# EAGLE design BLE121LR Breakout Board v1.0 (EAGLE 6.4)
BLE112 Breakout Board v2.0 Full breakout board for all BLE112 functions, with optional LEDs, programming header, USB access, etc.
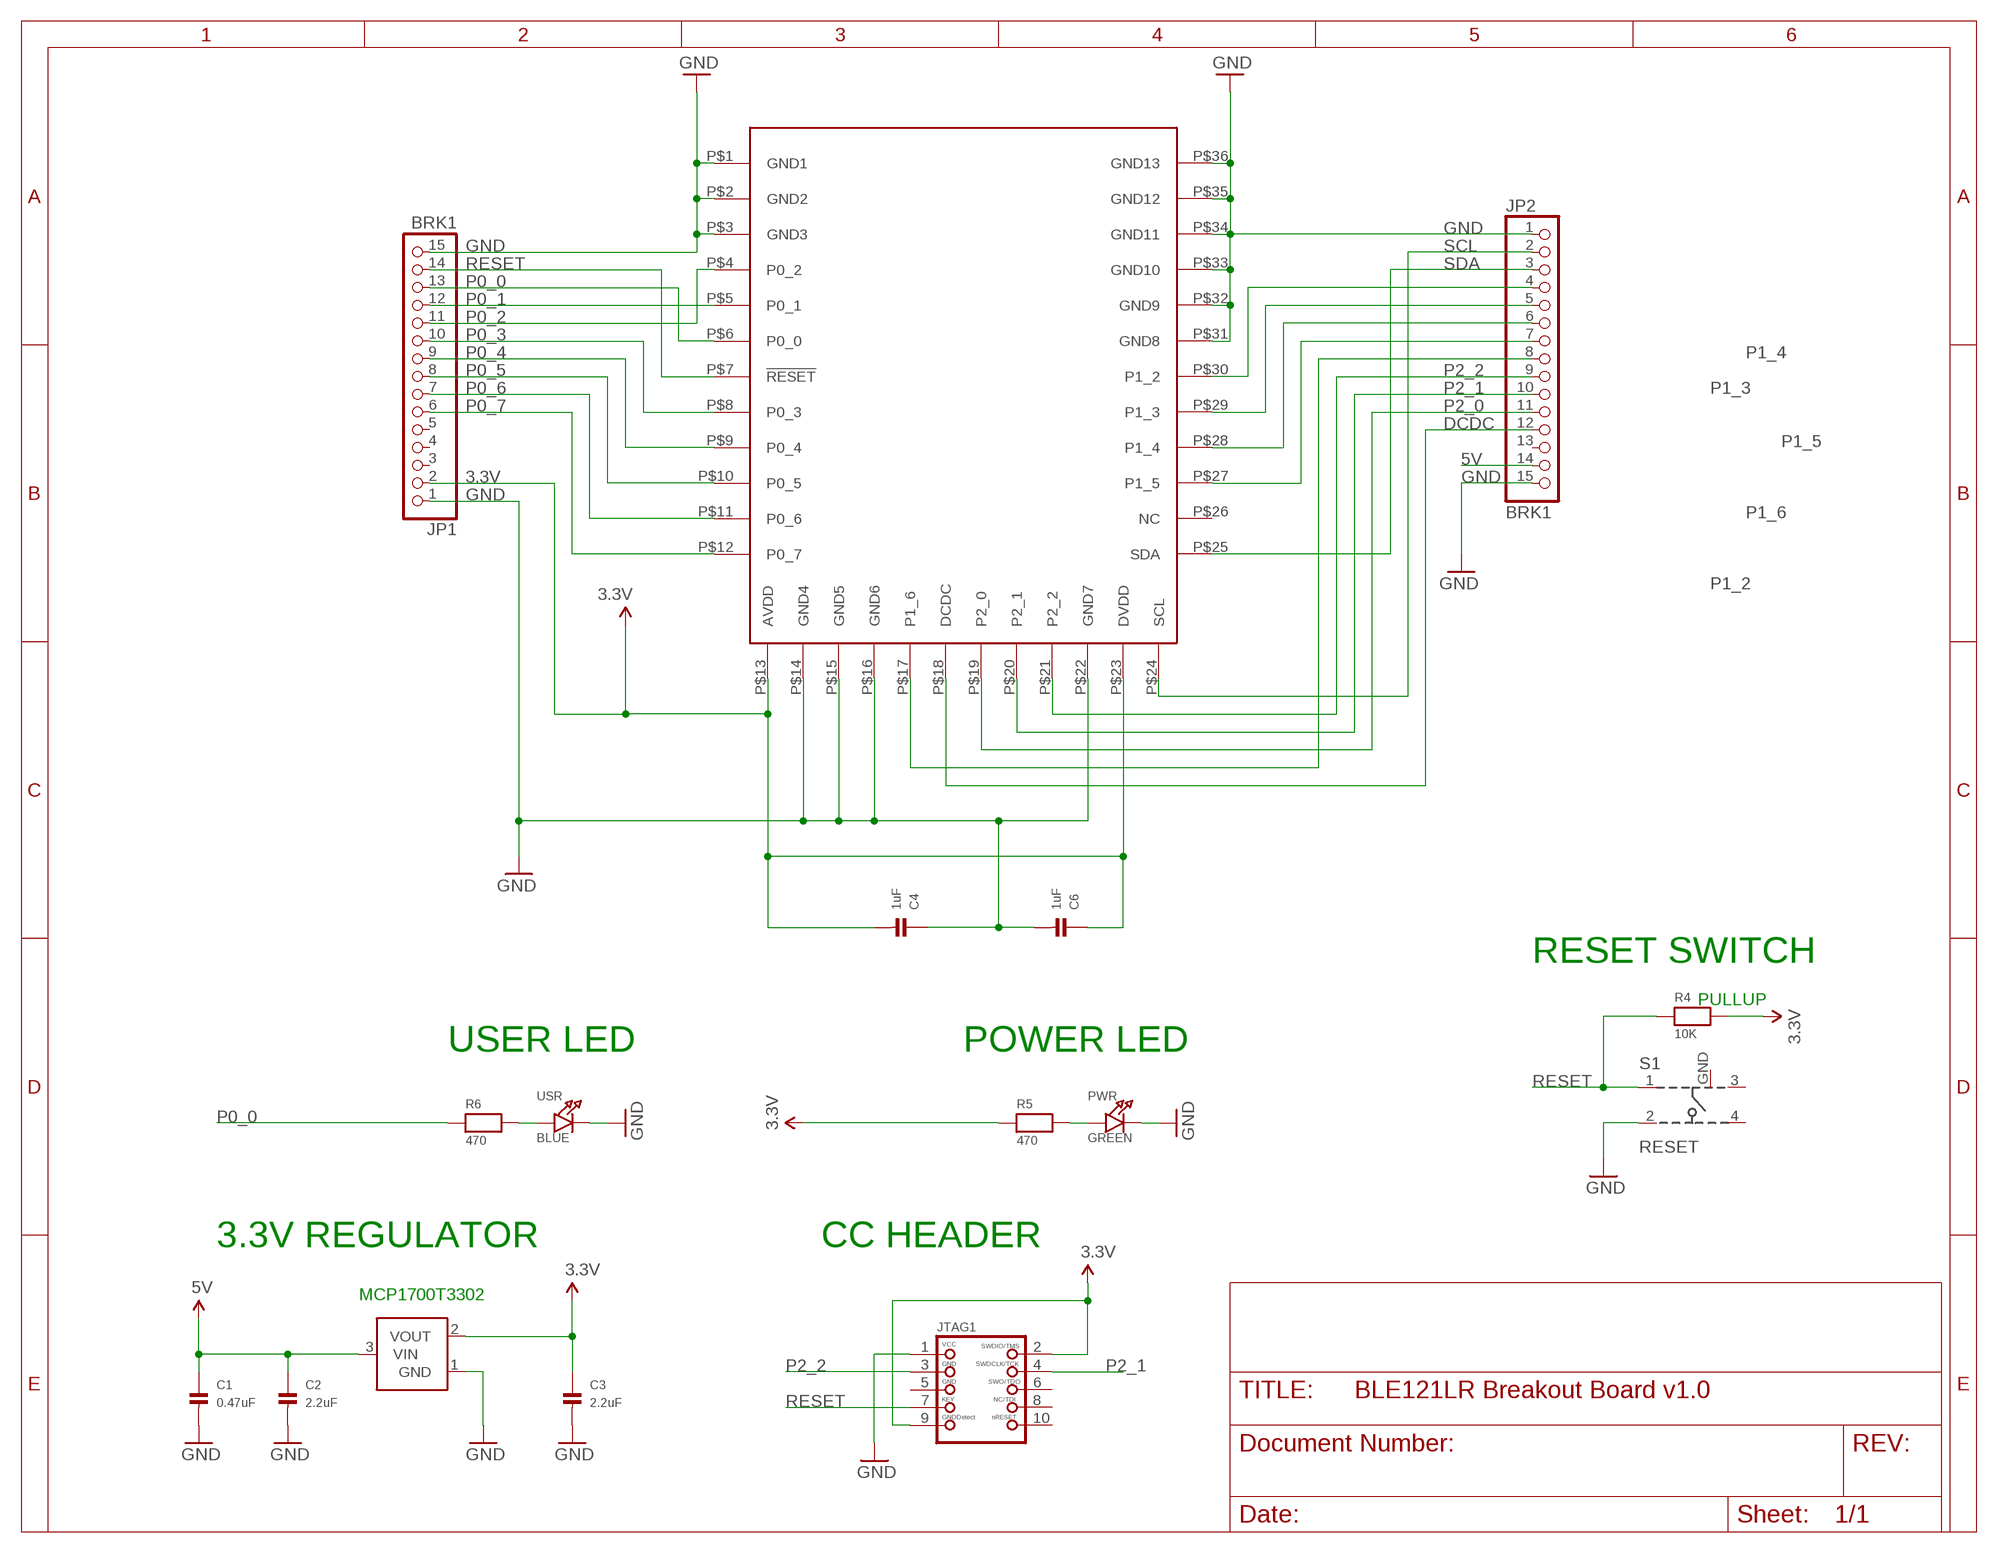
[diagram p0: schematic, sheet 1]

## Parts
C1  0.47uF  CAP_CERAMIC0603  [0603]
C2  2.2uF  CAP_CERAMIC0603  [0603]
C3  2.2uF  CAP_CERAMIC0603  [0603]
C4  1uF  CAP_CERAMIC0603  [0603]
C6  1uF  CAP_CERAMIC0603  [0603]
JP1  BRK1  PINHD-1X15  [1X15]
JP2  BRK1  PINHD-1X15  [1X15]
JTAG1  JTAG-CORTEXM3  [2X05_1.27MM_SMT]
PWR  GREEN  LED0603  [CHIPLED_0603]
R4  10K  RESISTOR0603  [0603]
R5  470  RESISTOR0603  [0603]
R6  470  RESISTOR0603  [0603]
S1  RESET  101-IG  [101-IG]
U2  MCP1700  [SOT23-3]
U$3  BLE121LR  [BLE121LR]
USR  BLUE  LED0603  [CHIPLED_0603]

## Nets
3.3V [power]: C3.1 C4.2 C6.1 JP1.2 JTAG1.2 JTAG1.9 R4.2 R5.1 U2.2(VOUT) U$3.P$13(AVDD) U$3.P$23(DVDD)
5V [power]: C1.1 C2.1 JP2.14 U2.3(VIN)
DCDC: JP2.12 U$3.P$18(DCDC)
GND [power]: C1.2 C2.2 C3.2 C4.1 C6.2 JP1.1 JP1.15 JP2.1 JP2.15 JTAG1.1 PWR.C S1.2 U2.1(GND) U$3.P$1(GND1) U$3.P$2(GND2) U$3.P$3(GND3) U$3.P$14(GND4) U$3.P$15(GND5) U$3.P$16(GND6) U$3.P$22(GND7) U$3.P$31(GND8) U$3.P$32(GND9) U$3.P$33(GND10) U$3.P$34(GND11) U$3.P$35(GND12) U$3.P$36(GND13) USR.C
N$1: PWR.A R5.2
N$4: R6.2 USR.A
P0_0: JP1.13 R6.1 U$3.P$6(P0_0)
P0_1: JP1.12 U$3.P$5(P0_1)
P0_2: JP1.11 U$3.P$4(P0_2)
P0_3: JP1.10 U$3.P$8(P0_3)
P0_4: JP1.9 U$3.P$9(P0_4)
P0_5: JP1.8 U$3.P$10(P0_5)
P0_6: JP1.7 U$3.P$11(P0_6)
P0_7: JP1.6 U$3.P$12(P0_7)
P1_2: JP2.4 U$3.P$30(P1_2)
P1_3: JP2.5 U$3.P$29(P1_3)
P1_4: JP2.6 U$3.P$28(P1_4)
P1_5: JP2.7 U$3.P$27(P1_5)
P1_6: JP2.8 U$3.P$17(P1_6)
P2_0: JP2.11 U$3.P$19(P2_0)
P2_1: JP2.10 JTAG1.4 U$3.P$20(P2_1)
P2_2: JP2.9 JTAG1.3 U$3.P$21(P2_2)
RESET: JP1.14 JTAG1.7 R4.1 S1.1 U$3.P$7(!RESET)
SCL: JP2.2 U$3.P$24(SCL)
SDA: JP2.3 U$3.P$25(SDA)
Unconnected: JP1.3 JP1.4 JP1.5 JP2.13 JTAG1.5 JTAG1.6 JTAG1.8 JTAG1.10 S1.3 S1.4 U$3.P$26(NC)

## Notes on the sheet
- RESET SWITCH
- PULLUP
- USER LED | POWER LED
- 3.3V REGULATOR | CC HEADER
- MCP1700T3302

## Power pins joined to a net without a drawn wire
GND: S1.GND

## Library data of the parts
C1-C4 C6 = microbuilder:CAP_CERAMIC: Ceramic Capacitors 0402 - 0402 Surface Mount Capacitors 16pF 50V 5% [Digikey: 445-4899-2-ND] 18pF 50V 5% [Digikey: 490-1281-2-ND] 22pF 50V 5% [Digikey: 490-1283-2-ND] 68pF 50V 5% [Digikey: 490-1289-2-ND] 0.1uF 10V 10% [Digikey: 490-1318-2-ND] 1.0uF 6.3V 10% [Digikey: 490-1320-2-ND] 0603 - 0603 Surface Mount Capacitors 16 pF 50V 5% [Digikey: 445-5051-2-ND] 22 pF 50V [Digikey: PCC220ACVTR-ND] 33 pF 50V 5% [Digikey: 490-1415-1-ND] 56pF 50V 5% [Digikey: 490-1421-1-ND] 220pF 50V 5% [Digikey: 445-1285-1-ND] 680 pF 50V 2200 pF 50V 5% C0G [Digikey: 445-1297-1-ND] 5600 pF 100V 5% X7R [Digikey: 478-3711-1-ND] 0.1 µF 25V 10% [Digikey: PCC2277TR-ND] 0.22 µF 16V 10% X7R [Digikey: 445-1318-1-ND] 1.0 µF 25V 10% [Digikey: 445-5146-2-ND] 0603 - RF Specific 3pF 250V +/-0.1pF RF [Digikey: 712-1347-1-ND] 18 pF 250V 5% [Digikey: 478-3505-1-ND or 712-1322-1-ND] 56 pF 250V 5% C0G RF [Digikey: 490-4867-1-ND] 68 pF 250V RF [Digikey: 490-4868-1-ND] 0805 - 0805 Surface Mount Capacitors 220 pF 250V 2% RF Ceramic Capacitor [Digikey: 712-1398-1-ND] 1000 pF 50V 2% NP0 Ceramic Capacitor [Digikey: 478-3760-1-ND] 0.1 µF 25V 10% Ceramic Capacitor [Digikey: PCC1828TR-ND] 1.0 µF 16V 10% Ceramic Capacitor[Digikey: 490-1691-2-ND] 10.0 µF 10V 10% Ceramic Capacitor[Digikey: 709-1228-1-ND] 10.0 uF 16V 10% Ceramic Capacitor [Digikey: 478-5165-2-ND] 47 uF 6.3V 20% Ceramic Capacitor [Digikey: 587-1779-1-ND or 399-5506-1-ND] 1206 - 1206 Surface Mount Capacitors 47uF 10V 20% Ceramic Capacitor [Digikey: 490-5528-1-ND or 399-5508-1-ND or 445-6010-1-ND] 100uF 6.3V -20%, +80% Y5V Ceramic Capacitor (Digikey: 490-4512-1-ND, Mouser: 81-GRM31CF50J107ZE1L)
JP1 JP2 = sf-pinhead:PINHD-1X15: PIN HEADER
JTAG1 = microbuilder:JTAG-CORTEXM3: Serial Wire (SW-DP) Connector This standard 0.05" 10-pin connector is for use with the Cortex M0/M3's native SWD (serial wire debugger) interface (SW-DP). Some boards support a 20-pin combined JTAG+SWD connector (SWJ-DP), such as the LPC1700 family, but many smaller devices only work with SWD which typically use the smaller 10-pin SW-DP connecter (the LPC1300 family, for example, only supports SWD). 2x05 1.27mm/0.05" Connector: This is the standard SMT connector defined by ARM for all Cortex devices, and should be used in most situations and for forward-compatibility since any new devices coming to market will likely use this connector. MOLEX 10 Pin 0.1" Connector: This 0.1" 10 pin connector has the same pin layout as the standard 0.05" connector, but is easier to work with if you are using standard jumper wires or custom cables to connect your SWD hardware. MOLEX 20 Pin 0.1" Connector: This 0.1" 20 pin connector is the same model used for ARM7/ARM9 JTAG debuggers, but is connected to match the pins on the Segger J-Link for ARM (which supports both JTAG and SWD debugging). See the following document from ARM for more information on Cortex M3 Debug Connectors: http://infocenter.arm.com/help/topic/com.arm.doc.faqs/attached/13634/cortex_debug_connectors.pdf And the following page for an overview with images of the different connector types: http://www.keil.com/peripherals/coresight/connectors.asp
PWR USR = microbuilder:LED: LED 0603 - 0603 Surface Mount Package 2mA: Green LED - Low Power (3.9mcd, 2ma, 1.7Vf) - Digikey: 475-2709-2-ND Orange LED - Low Power (9.8mcd, 2ma, 1.8Vf) - Digikey: 475-1194-2-ND Red LED - Low Power (5mcd, 2ma, 1.8Vf) - Digikey: 475-1195-2-ND Yellow LED - Low Power (7mcd, 2ma, 1.8Vf) - Digikey: 475-1196-2-ND 5mA: Blue LED - Low Power (17mcd, 5ma, 2.9Vf) - Digikey: LNJ937W8CRACT-ND 0805 - 0805 Surface Mount Package 2mA: Red LED (8.8mcd, 2mA, 1.8Vf, Clear) - Low Power [Digikey: 475-2510-1-ND] Green LED (5mcd, 2mA, 1.8Vf, Clear) - Low Power [Digikey: 475-2730-1-ND] Yellow LED (11.3mcd, 2mA, 1.8Vf, Clear) - Low Power [Digikey: 475-2555-1-ND] 20mA: Red LED (104mcd, 20mA, Diffused) - LS R976 [Digikey: 475-1278-6-ND] Red LED (12mcd, 20mA, 2.0Vf, Clear) - APT2012EC [Digikey: 754-1128-1-ND] Green LED (15mcd, 20mA, 2.2Vf, Clear) - APT2012GC [Digikey: 754-1131-1-ND] Orange LED (160mcd, 20mA, 2.1Vf, Clear) - APT2012SECK [Digikey: 754-1130-1-ND] 1206 - 1206 Surface Mount Package Green LED (26mcd, 20mA, Diffused) - LG N971 [Digikey: 475-1407-6-ND] Red LED (15mcd, 20mA, Diffused) - LH N974 [Digikey: 475-1416-6-ND]
R4-R6 = microbuilder:RESISTOR: Resistors 0402 - 0402 Surface Mount Package 22 Ohm 1% 1/16W [Digikey: 311-22.0LRTR-ND] 33 Ohm 5% 1/16W 1.0K 5% 1/16W 1.5K 5% 1/16W 2.0K 1% 1/16W 10.0K 1% 1/16W [Digikey: 311-10.0KLRTR-ND] 10.0K 5% 1/16W [Digikey: RMCF0402JT10K0TR-ND] 12.1K 1% 1/16W [Digikey: 311-22.0LRTR-ND] 100.0K 5% 1/16W 0603 - 0603 Surface Mount Package 0 Ohm 1/10 Watt 1% Resistor 15 Ohm 1/10 Watt 1% Resistor 33 Ohm 1/10 Watt 1% Resistor 49.9 Ohm 1/10 Watt 1% Resistor 100 Ohm 1/10 Watt 1% Resistor 150 Ohm 1/10 Watt 1% Resistor 240 Ohm 1/10 Watt 1% Resistor 390 Ohm 1/10 Watt 1% Resistor 560 Ohm 1/10 Watt 1% Resistor 680 Ohm 1/10 Watt 1% Resistor 750 Ohm 1/10 Watt 1% Resistor 1.0K Ohm 1/10 Watt 1% Resistor 1.5K Ohm 1/10 Watt 1% Resistor 2.0K Ohm 1/10 Watt 1% Resistor 2.2K Ohm 1/10 Watt 1% Resistor 3.3K Ohm 1/10 Watt 1% Resistor 4.7K Ohm 1/10 Watt 1% Resistor 10.0K Ohm 1/10 Watt 1% Resistor 12.0K Ohm 1/10 Watt 1% Resistor 12.1K Ohm 1/10 Watt 1% Resistor 20.0K Ohm 1/10 Watt 1% Resistor 33.0K Ohm 1/10 Watt 1% Resistor 100.0K Ohm 1/10 Watt 1% Resistor 0805 - 0805 Surface Mount Package 0 Ohm 1/8 Watt 1% Resistor 33 Ohm 1/8 Watt 1% Resistor 100 Ohm 1/8 Watt 1% Resistor 150 Ohm 1/8 Watt 1% Resistor 200 Ohm 1/8 Watt 1% Resistor 240 Ohm 1/8 Watt 1% Resistor 330 Ohm 1/8 Watt 1% Resistor 390 Ohm 1/8 Watt 1% Resistor 470 Ohm 1/8 Watt 1% Resistor 1.0K Ohm 1/8 Watt 1% Resistor 1.5K Ohm 1/8 Watt 1% Resistor 2.0K Ohm 1/8 Watt 1% Resistor 4.7K Ohm 1/8 Watt 1% Resistor 5.1K Ohm 1/8 Watt 1% Resistor 5.6K Ohm 1/8 Watt 1% Resistor 10.0K Ohm 1/8 Watt 1% Resistor 22.0K Ohm 1/8 Watt 1% Resistor 33.0K Ohm 1/8 Watt 1% Resistor 100K Ohm 1/8 Watt 1% Resistor 1206 - 1206 Surface Mount Package 2012 - 2010 Surface Mount Package 0.11 Ohm 1/2 Watt 1% Resistor - Digikey: RHM.11UCT-ND
S1 = sf-keyglove:101-IG
U2 = nonolith:MCP1700: Voltage regulator
U$3 = sf-bluegiga:BLE121LR: BLE121LR

## Net classes
0 default: width 0.152 mm, drill 0.33 mm, clearance 0.152 mm
1 power: width 0.254 mm, drill 0.33 mm, clearance 0.152 mm

## Board
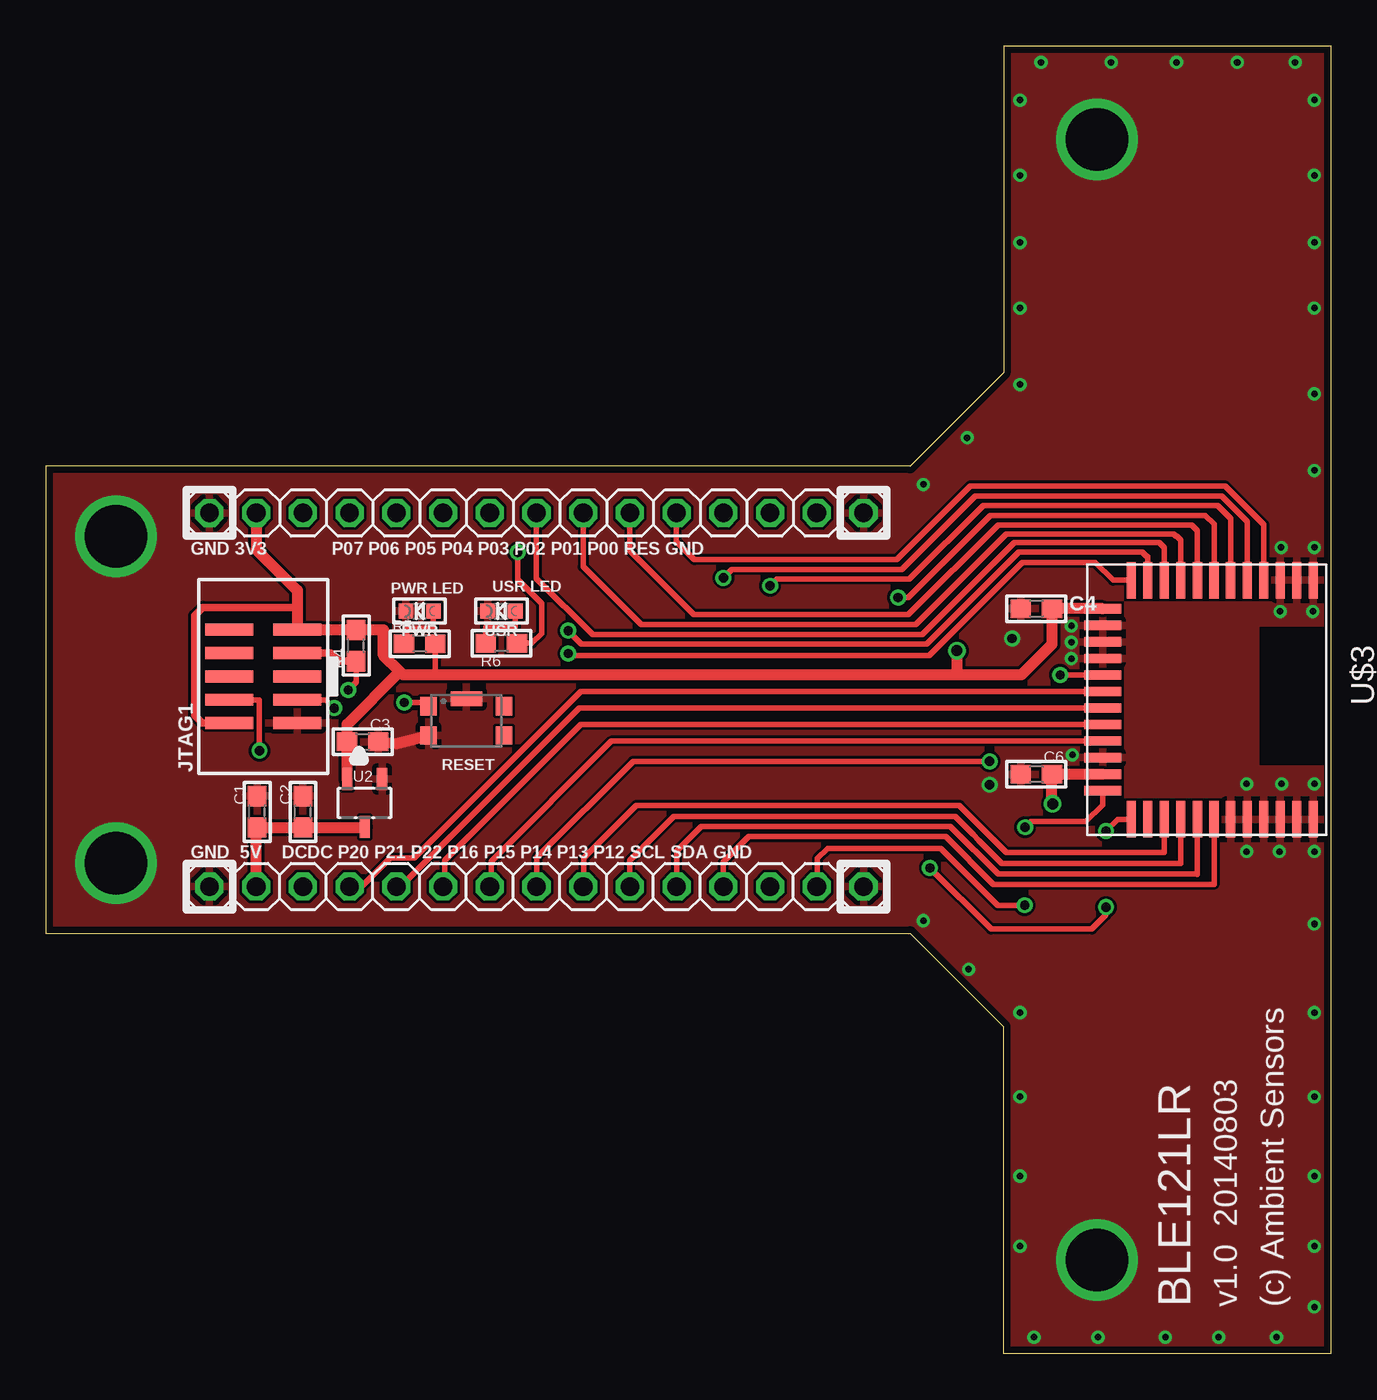
[diagram p1: board, top side]
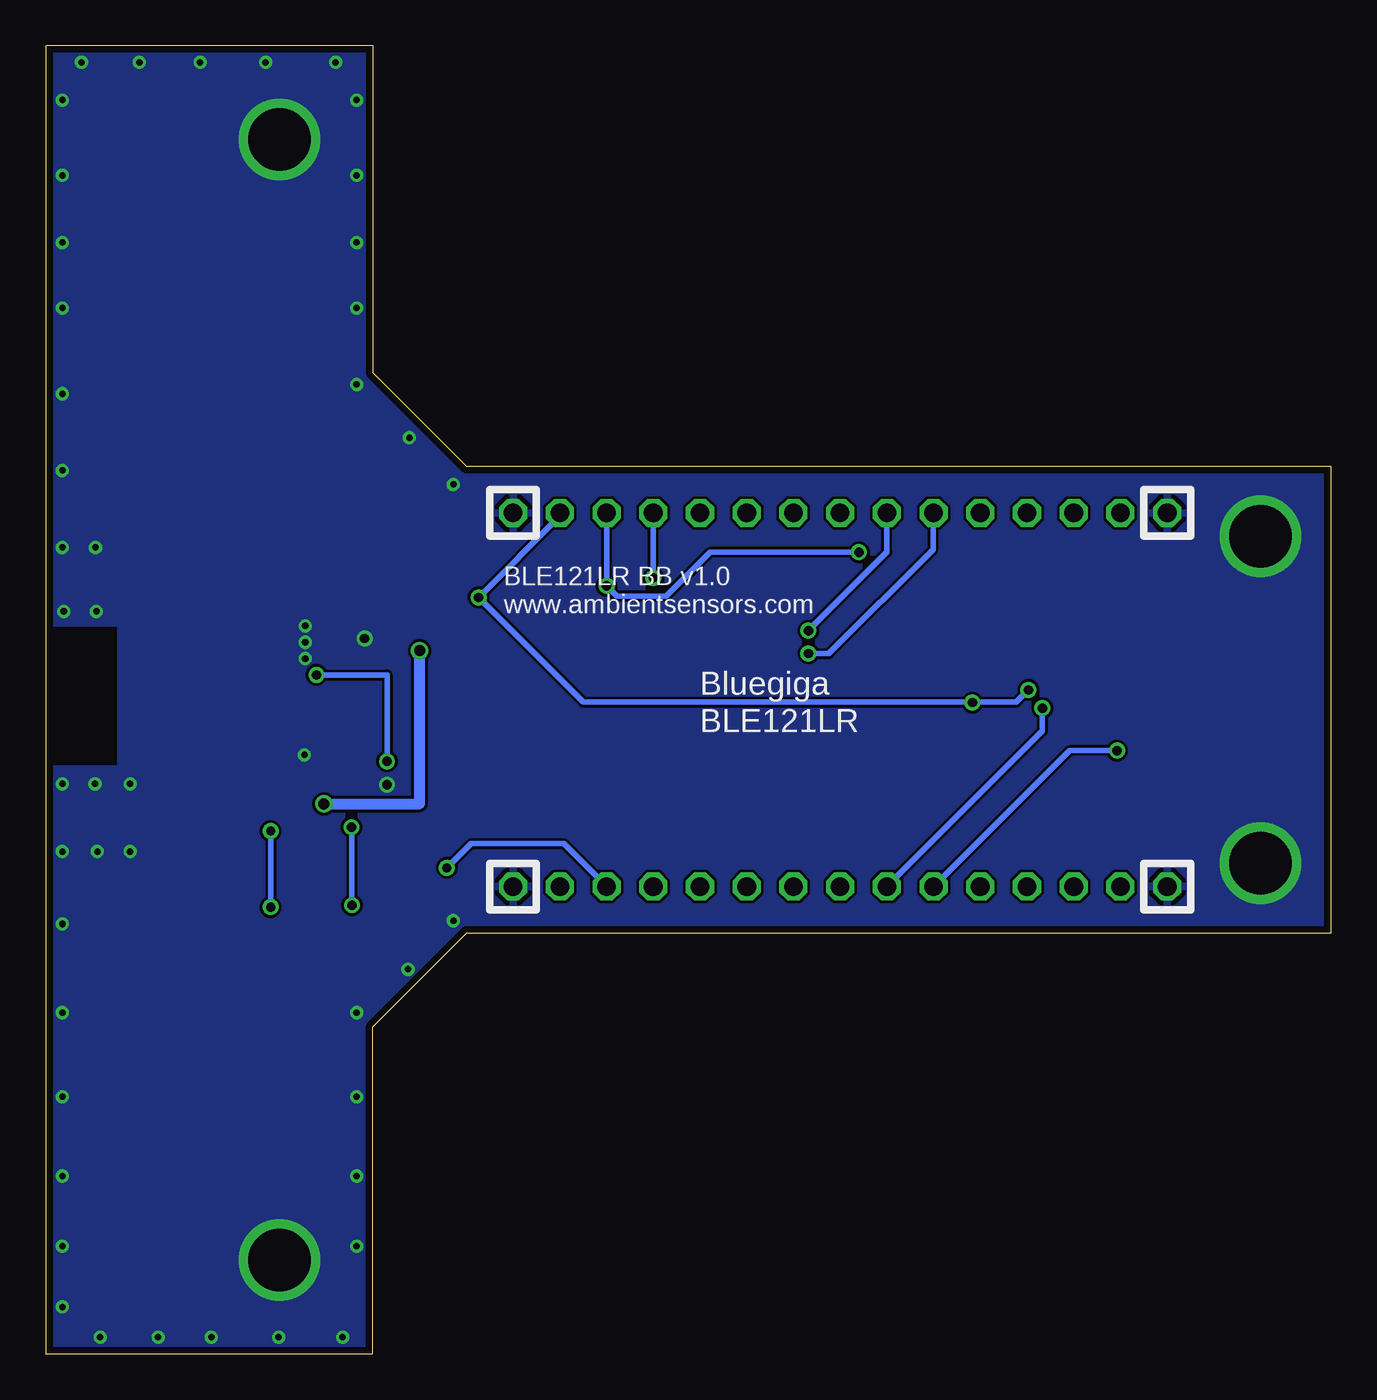
[diagram p2: board, bottom side, seen from below]

Size 69.85 x 71.12 mm. Coordinates in mm from the lower left corner, seen from the top.
Outline: 0,22.86 46.99,22.86 52.07,17.78 52.07,0 69.85,0 69.85,71.12 52.07,71.12 52.07,53.34 46.99,48.26 0,48.26 0,22.86
Copper layers (1*16): Top 0.0356mm / dielectric 1.5011mm / Bottom 0.0356mm
Design rules "default": minimum track width 6mil, minimum drill 13mil, track to track 6mil, track to pad 6mil, pad to pad 6mil, via to via 6mil, smd to smd 6mil, copper to edge 15mil, drill to drill 6mil, minimum pad ring 7mil, minimum via ring 7mil, stop-mask expansion 4mil, vias tented up to drill 13mil, thermal gap 10mil

### Footprints (pad centres in the part's own frame; a part is rotated, then mirrored left to right if it is on the bottom)
0603 = smd 1.1 x 1: 1 -0.85,0; 2 0.85,0
1X15 = drill 1.016 octagon: 1 -17.78,0; 2 -15.24,0; 3 -12.7,0; 4 -10.16,0; 5 -7.62,0; 6 -5.08,0; 7 -2.54,0; 8 0,0; 9 2.54,0; 10 5.08,0; 11 7.62,0; 12 10.16,0; 13 12.7,0; 14 15.24,0; 15 17.78,0
2X05_1.27MM_SMT = smd 0.65 x 2.6: 1 -2.54,-1.85; 2 -2.54,1.85; 3 -1.27,-1.85; 4 -1.27,1.85; 5 0,-1.85; 6 0,1.85; 7 1.27,-1.85; 8 1.27,1.85; 9 2.54,-1.85; 10 2.54,1.85
CHIPLED_0603 = smd 0.8 x 0.8: A 0,-0.75; C 0,0.75
101-IG = smd 0.9 x 1: 1 -2.05,0.8; 2 -2.05,-0.8; 3 2.05,0.8; 4 2.05,-0.8 | smd 1.7 x 0.8: GND 0,1.2
SOT23-3 = smd 0.55 x 1.2: 1 0.95,1.3; 2 -0.95,1.3; 3 0,-1.3
BLE121LR = smd 2 x 0.5: P$1 -6.5,4.95; P$2 -6.5,4.05; P$3 -6.5,3.15; P$4 -6.5,2.25; P$5 -6.5,1.35; P$6 -6.5,0.45; P$7 -6.5,-0.45; P$8 -6.5,-1.35; P$9 -6.5,-2.25; P$10 -6.5,-3.15; P$11 -6.5,-4.05; P$12 -6.5,-4.95; P$25 6.5,-4.95; P$26 6.5,-4.05; P$27 6.5,-3.15; P$28 6.5,-2.25; P$29 6.5,-1.35; P$30 6.5,-0.45; P$31 6.5,0.45; P$32 6.5,1.35; P$33 6.5,2.25; P$34 6.5,3.15; P$35 6.5,4.05; P$36 6.5,4.95 | smd 0.5 x 2: P$13 -4.95,-6.5; P$14 -4.05,-6.5; P$15 -3.15,-6.5; P$16 -2.25,-6.5; P$17 -1.35,-6.5; P$18 -0.45,-6.5; P$19 0.45,-6.5; P$20 1.35,-6.5; P$21 2.25,-6.5; P$22 3.15,-6.5; P$23 4.05,-6.5; P$24 4.95,-6.5

### Placement (x,y rotation side)
C1  11.48,29.46 90 top
C2  13.97,29.46 90 top
C3  17.22,33.27 0 top
C4  53.85,40.51 0 top
C6  53.85,31.51 180 top
JP1  26.67,45.72 0 top
JP2  26.67,25.4 180 top
JTAG1  11.81,36.83 90 top
PWR  20.32,40.39 90 top
R4  16.87,38.51 90 top
R5  20.32,38.61 180 top
R6  24.77,38.63 180 top
S1  22.86,34.42 0 top
U2  17.32,29.95 0 top
U$3  63.96,35.56 270 top
USR  24.77,40.39 90 top

### Tracks (layer width: path | path; a pad name or v marks a point on that pad's centre or on a via)
3.3V  (via drill 0.6)
  Top 0.305: R5.1 21.17,37.02 21.06,36.91
  Top 0.406: 55.08,31.51 C6.1 | JTAG1.2 8.48,34.29 8.08,34.7 8.08,40.13 8.53,40.59 13.64,40.59 13.66,40.56 | 16.37,33.17 C3.1
  Top 0.61: U$3.P$13 55.08,40.51 C4.2 54.7,38.57 53.04,36.91 49.53,36.91 | 49.53,36.91 21.06,36.91 19.41,36.91 19.23,37.08 | 19.23,37.08 18.34,37.97 18.34,39.36 R4.2 13.66,39.36 JTAG1.9 13.66,40.56 13.66,41.5 11.43,43.74 JP1.2 | v49.53,38.23 49.53,36.91 | U$3.P$23 55.08,31.51 C6.1 54.7,29.9 v54.74,29.9 | U2.2 16.37,33.17 | C3.1 16.37,34.23 19.23,37.08
  Bottom 0.61: v54.74,29.9 49.53,29.9 v49.53,38.23
5V
  Top 0.61: JP2.14 11.43,28.56 C1.1 C2.1 17.29,28.61 U2.3
DCDC
  Top 0.305: JP2.12 17.17,25.4 18.72,26.95 20.02,26.95 29.08,36.01 U$3.P$18
GND  (via drill 0.36, 0.51, 3.4)
  Top 0.61: C3.2 19.07,33.17 S1.2
  other vias: 52.53,38.89 51.31,30.94 55.75,39.57 55.75,38.68 55.75,37.8 55.8,32.56 67.16,43.84 68.96,43.84 67.11,40.36 68.88,40.36 65.28,30.99 67.18,30.99 68.96,30.99 65.28,27.3 67.06,27.3 68.96,27.3 47.7,47.27 50.09,49.81 52.96,52.7 52.96,56.87 52.96,60.43 52.96,64.08 52.96,68.17 54.1,70.23 57.91,70.23 61.47,70.23 64.77,70.23 67.92,70.23 68.96,68.17 68.96,64.08 68.96,60.43 68.96,56.87 68.96,52.2 68.96,48.03 47.7,23.55 50.16,20.9 52.96,18.54 52.96,13.97 52.96,9.65 52.96,5.84 53.72,0.89 57.2,0.89 60.86,0.89 63.75,0.89 66.9,0.89 68.96,2.54 68.96,5.84 68.96,9.65 68.96,13.97 68.96,18.54 68.96,23.37 57.15,66.04 3.81,44.45 3.81,26.67 57.15,5.08
  pour Bottom: 0,71.12 69.85,71.12 69.85,0 0,0
  pour Top: 0,71.12 69.85,71.12 69.85,0 0,0
N$1
  Top 0.305: R5.2 19.61,38.61 19.61,39.47 21.07,39.47 PWR.A
N$4
  Top 0.305: R6.2 23.9,39.52 25.52,39.52 USR.A
P0_0  (via drill 0.51)
  Top 0.305: U$3.P$6 64.41,45.42 63.7,46.13 50.95,46.13 46.94,42.11 39.73,42.11 v39.37,41.76 | R6.1 26.42,38.63 26.95,39.17 26.95,40.79 25.65,42.09 v25.65,43.59
  Bottom 0.305: JP1.13 v39.37,41.76 38.81,41.2 36.12,41.2 33.73,43.59 v25.65,43.59
P0_1  (via drill 0.51)
  Top 0.305: U$3.P$5 65.31,45.26 63.93,46.63 50.52,46.63 46.53,42.65 37.29,42.65 v36.83,42.19
  Bottom 0.305: v36.83,42.19 JP1.12
P0_2
  Top 0.305: U$3.P$4 66.22,45.09 64.11,47.19 50.27,47.19 46.25,43.18 35.26,43.18 34.27,44.17 34.27,45.7 JP1.11
P0_3
  Top 0.305: U$3.P$8 62.61,44.76 62.31,45.06 51.77,45.06 46.89,40.18 35.23,40.18 31.75,43.66 JP1.10
P0_4
  Top 0.305: U$3.P$9 61.71,44.24 61.47,44.47 61.42,44.47 61.32,44.58 52.22,44.58 47.3,39.65 32.36,39.65 29.21,42.8 JP1.9
P0_5
  Top 0.305: U$3.P$10 60.81,43.84 60.53,44.12 52.65,44.12 47.65,39.12 29.72,39.12 26.67,42.16 JP1.8
P0_6  (via drill 0.51)
  Top 0.305: U$3.P$11 59.91,43.34 59.86,43.34 59.61,43.59 52.88,43.59 47.88,38.58 29.11,38.58 28.4,39.29 v28.4,39.32
  Bottom 0.305: v28.4,39.32 24.13,43.59 JP1.7
P0_7  (via drill 0.51)
  Top 0.305: U$3.P$12 58.02,42.06 57.05,43.03 53.09,43.03 48.03,37.97 28.5,37.97 v28.4,38.08
  Bottom 0.305: v28.4,38.08 27.28,38.08 21.62,43.74 21.62,45.7 JP1.6
P1_2
  Top 0.305: U$3.P$30 63.51,25.53 51.51,25.53 48.92,28.12 38.2,28.12 36.83,26.75 JP2.4
P1_3
  Top 0.305: U$3.P$29 62.61,26.06 62.59,26.06 62.59,26.09 51.77,26.09 49.17,28.68 35.64,28.68 34.29,27.33 JP2.5
P1_4
  Top 0.305: U$3.P$28 61.71,26.67 51.97,26.67 50.72,27.91 50.41,28.23 49.43,29.21 34.14,29.21 31.75,26.82 JP2.6
P1_5
  Top 0.305: U$3.P$27 60.81,27.25 52.22,27.25 49.66,29.82 32.11,29.82 29.23,26.95 29.23,25.43 JP2.7
P1_6  (via drill 0.51)
  Top 0.305: v51.31,32.21 31.93,32.21 26.7,26.98 26.7,25.43 JP2.8 | U$3.P$17 v55.14,36.91
  Bottom 0.305: v55.14,36.91 51.31,36.91 v51.31,32.21
P2_0
  Top 0.305: JP2.11 19.28,25.4 28.99,35.11 U$3.P$19
P2_1  (via drill 0.51)
  Top 0.305: U$3.P$20 29.08,34.21 21.69,26.82 21.69,25.5 JP2.10 | JTAG1.4 11.61,35.56 v11.61,32.79
  Bottom 0.305: v11.61,32.79 14.2,32.79 JP2.10
P2_2  (via drill 0.51)
  Top 0.305: U$3.P$21 30.74,33.31 24.21,26.77 24.21,25.48 JP2.9 | JTAG1.3 15.21,35.56 v15.67,35.1
  Bottom 0.305: v15.67,35.1 15.67,33.86 JP2.9
RESET  (via drill 0.51)
  Top 0.305: U$3.P$7 63.51,45.1 63.04,45.57 51.33,45.57 46.89,41.12 v46.33,41.12 | R4.1 16.87,36.52 v16.43,36.09 | v19.48,35.41 20.81,35.41 S1.1
  Top 0.406: JTAG1.7 15.49,38.1 15.93,37.67 16.85,37.67 R4.1
  Bottom 0.305: 19.48,35.43 40.64,35.43 v46.33,41.12 41.91,45.54 JP1.14 | 19.48,35.43 v19.48,35.41 | 19.48,35.43 17.09,35.43 v16.43,36.09
SCL  (via drill 0.51)
  Top 0.305: U$3.P$24 57.46,29.85 56.54,28.93 53.54,28.93 v53.24,28.63 | v53.21,24.38 51.74,24.38 48.64,27.48 42.49,27.48 41.94,26.92 41.94,25.43 JP2.2
  Bottom 0.305: v53.24,28.63 53.24,24.41 v53.21,24.38
SDA  (via drill 0.51)
  Top 0.305: U$3.P$25 58.27,29.06 v57.63,28.42 | v57.63,24.28 57.63,23.85 56.87,23.09 51.38,23.09 v48.06,26.42
  Bottom 0.305: v57.63,28.42 v57.63,24.28 | JP2.3 41.71,27.74 46.74,27.74 v48.06,26.42

### Text on the board
tPlace: GND 3V3 P07 P06 P05 P04 P03 P02 P01 P00 RES GND | USR LED | PWR LED | RESET | GND 5V DCDC P20 P21 P22 P16 P15 P14 P13 P12 SCL SDA GND | BLE121LR | v1.0 20140803 | (c) Ambient Sensors
bPlace: BLE121LR BB v1.0 | www.ambientsensors.com | Bluegiga | BLE121LR